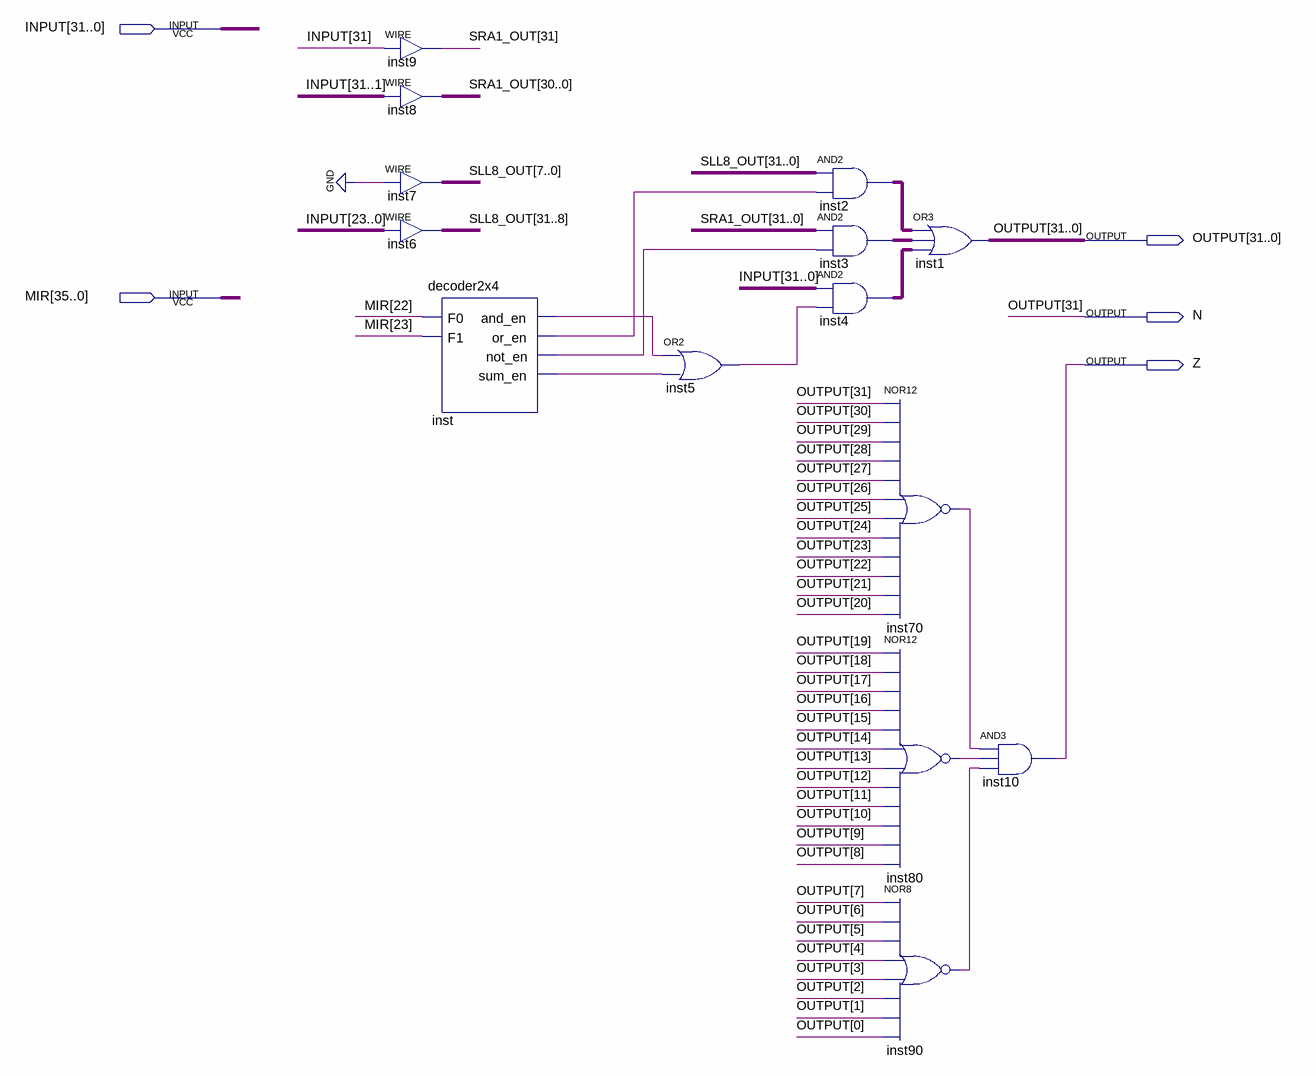
[diagram p0: schematic sheet]
// Quartus schematic SHIFTER.bdf as structural Verilog: 14 symbols, 5 pins
module SHIFTER (
  input  [31:0] INPUT,
  input  [35:0] MIR,
  output [31:0] OUTPUT,
  output N,
  output Z
);

  wire inst5_out, inst70_out, inst80_out, inst90_out, inst_and_en, inst_not_en, inst_or_en, inst_sum_en;
  wire [31:0] inst2_out, inst3_out, inst4_out, SLL8_OUT, SRA1_OUT;

  assign SRA1_OUT[31] = INPUT[31];  // WIRE inst9
  assign SRA1_OUT[30:0] = INPUT[31:1];  // WIRE inst8
  assign SLL8_OUT[7:0] = {8{1'b0}};  // WIRE inst7
  assign SLL8_OUT[31:8] = INPUT[23:0];  // WIRE inst6
  decoder2x4 inst (
    .F0(MIR[22]), .F1(MIR[23]), .and_en(inst_and_en), .or_en(inst_or_en), .not_en(inst_not_en),
    .sum_en(inst_sum_en));
  or inst5 (inst5_out, inst_and_en, inst_sum_en);
  assign inst2_out = SLL8_OUT & {32{inst_or_en}};  // AND2 inst2, 32 bits wide
  assign inst3_out = SRA1_OUT & {32{inst_not_en}};  // AND2 inst3, 32 bits wide
  assign inst4_out = INPUT & {32{inst5_out}};  // AND2 inst4, 32 bits wide
  nor inst70 (inst70_out, N, OUTPUT[30], OUTPUT[29], OUTPUT[28], OUTPUT[27], OUTPUT[26], OUTPUT[25], OUTPUT[24], OUTPUT[23], OUTPUT[22], OUTPUT[21], OUTPUT[20]);
  nor inst80 (inst80_out, OUTPUT[19], OUTPUT[18], OUTPUT[17], OUTPUT[16], OUTPUT[15], OUTPUT[14], OUTPUT[13], OUTPUT[12], OUTPUT[11], OUTPUT[10], OUTPUT[9], OUTPUT[8]);
  nor inst90 (inst90_out, OUTPUT[7], OUTPUT[6], OUTPUT[5], OUTPUT[4], OUTPUT[3], OUTPUT[2], OUTPUT[1], OUTPUT[0]);
  assign {N, OUTPUT[30:0]} = inst2_out | inst3_out | inst4_out;  // OR3 inst1, 32 bits wide
  and inst10 (Z, inst70_out, inst80_out, inst90_out);

  assign OUTPUT[31] = N;
endmodule
